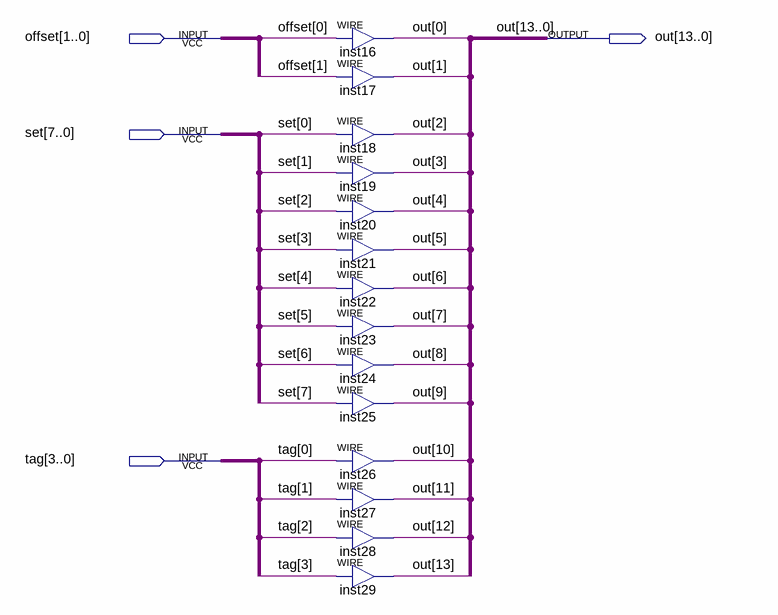
[diagram p0: schematic sheet]
// Quartus schematic make_addr.bdf as structural Verilog: 14 symbols, 4 pins
module make_addr (
  input  [1:0] offset,
  input  [7:0] set,
  input  [3:0] tag,
  output [13:0] out
);

  assign out[0] = offset[0];  // WIRE inst16
  assign out[1] = offset[1];  // WIRE inst17
  assign out[2] = set[0];  // WIRE inst18
  assign out[3] = set[1];  // WIRE inst19
  assign out[4] = set[2];  // WIRE inst20
  assign out[5] = set[3];  // WIRE inst21
  assign out[6] = set[4];  // WIRE inst22
  assign out[7] = set[5];  // WIRE inst23
  assign out[8] = set[6];  // WIRE inst24
  assign out[9] = set[7];  // WIRE inst25
  assign out[10] = tag[0];  // WIRE inst26
  assign out[11] = tag[1];  // WIRE inst27
  assign out[12] = tag[2];  // WIRE inst28
  assign out[13] = tag[3];  // WIRE inst29
endmodule
